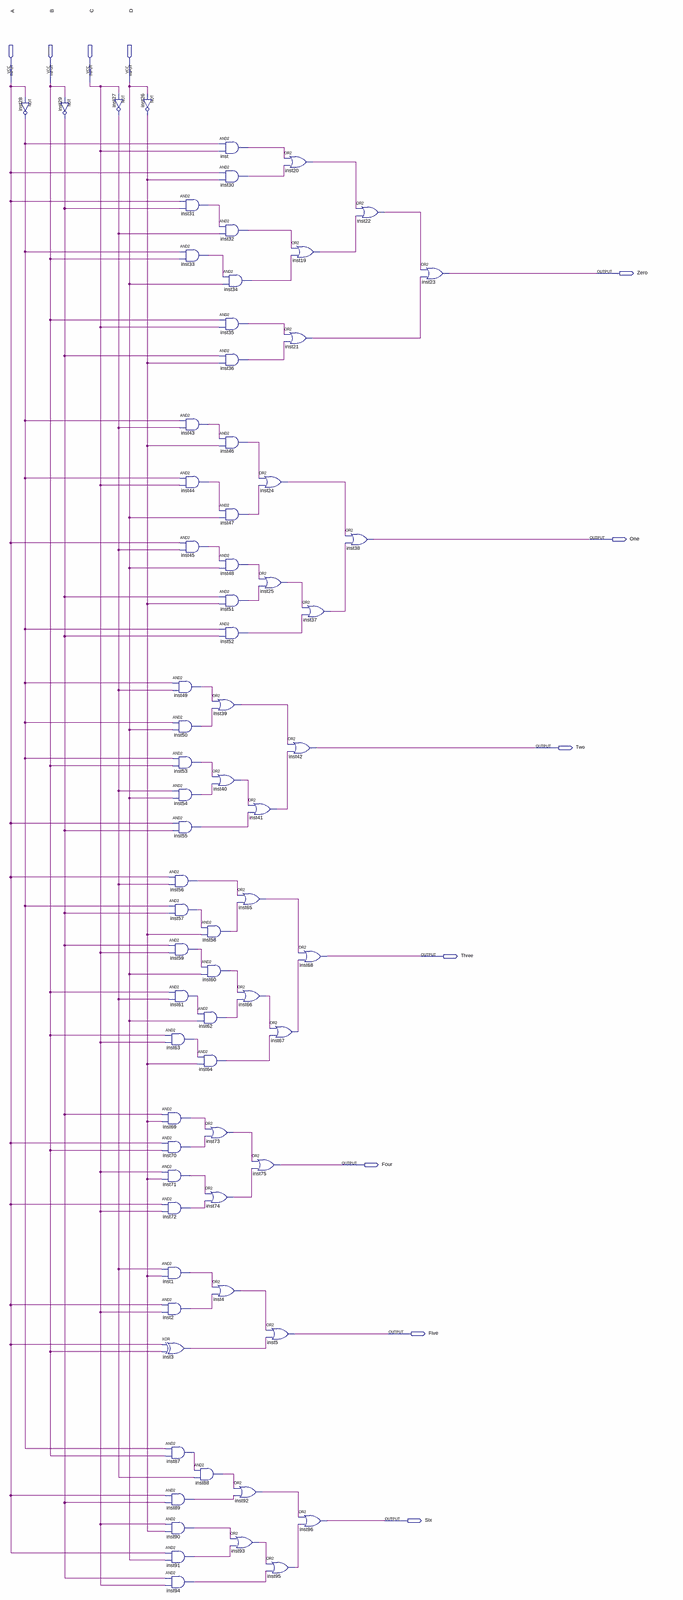
[diagram p0: schematic sheet, whole]
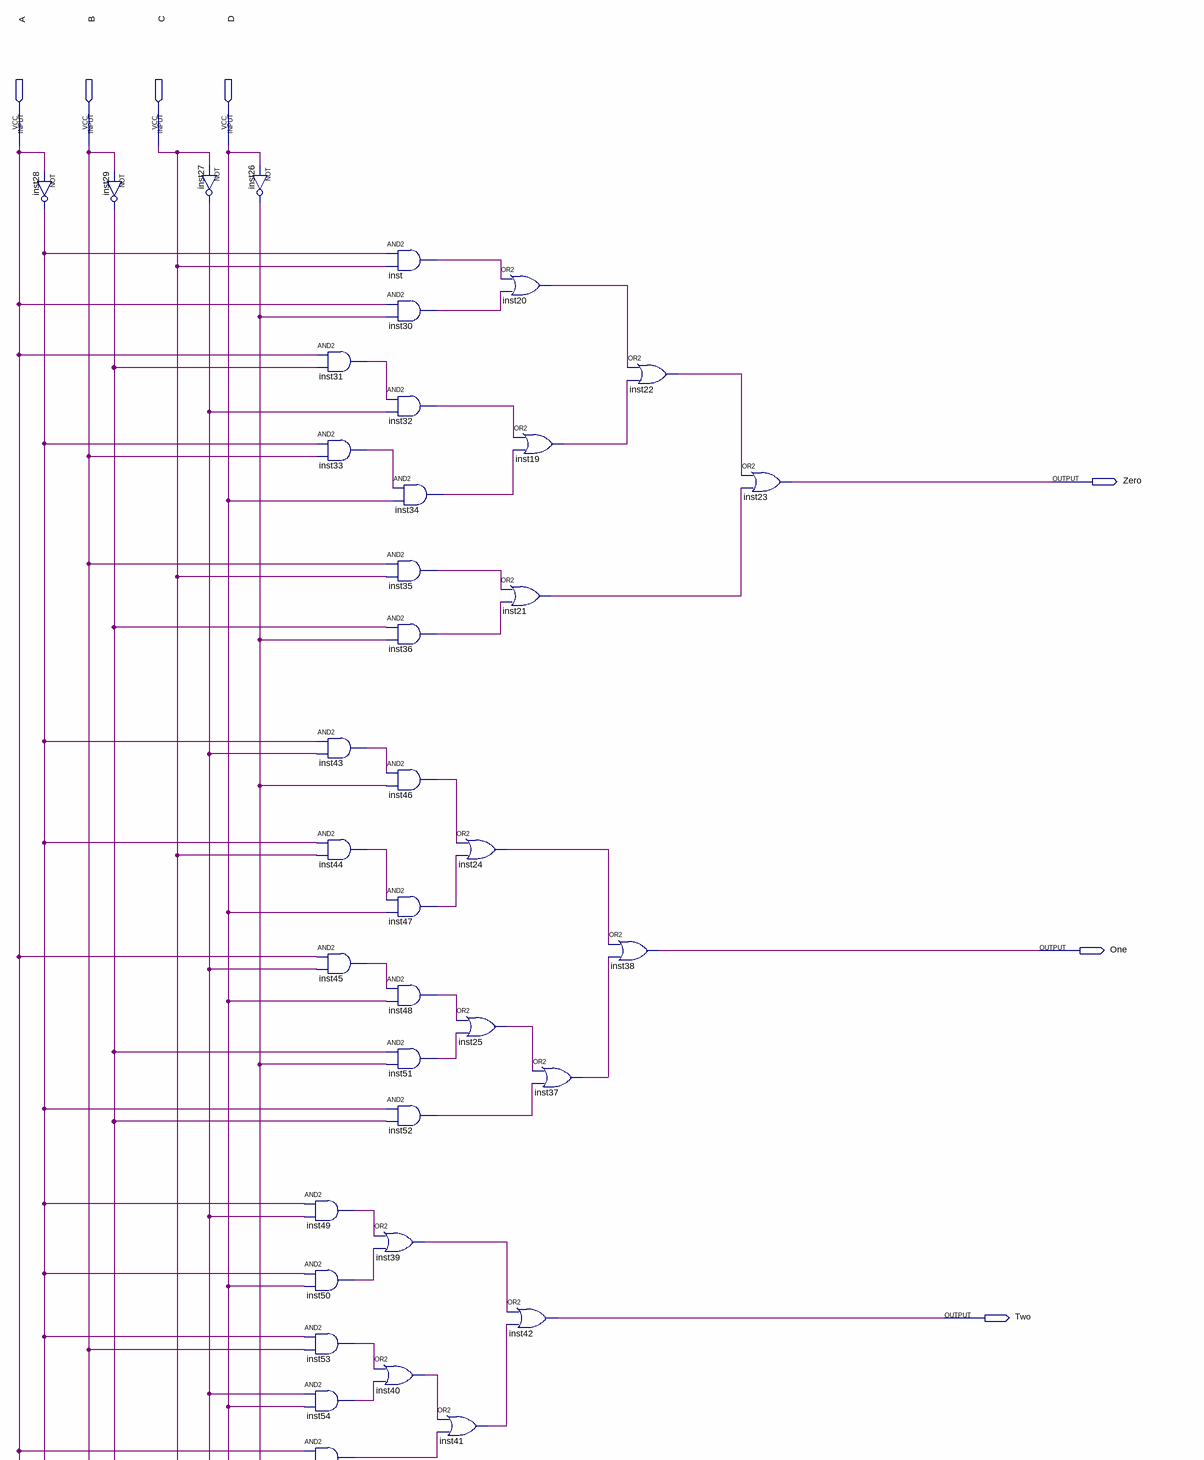
[diagram p1: schematic sheet, upper part]
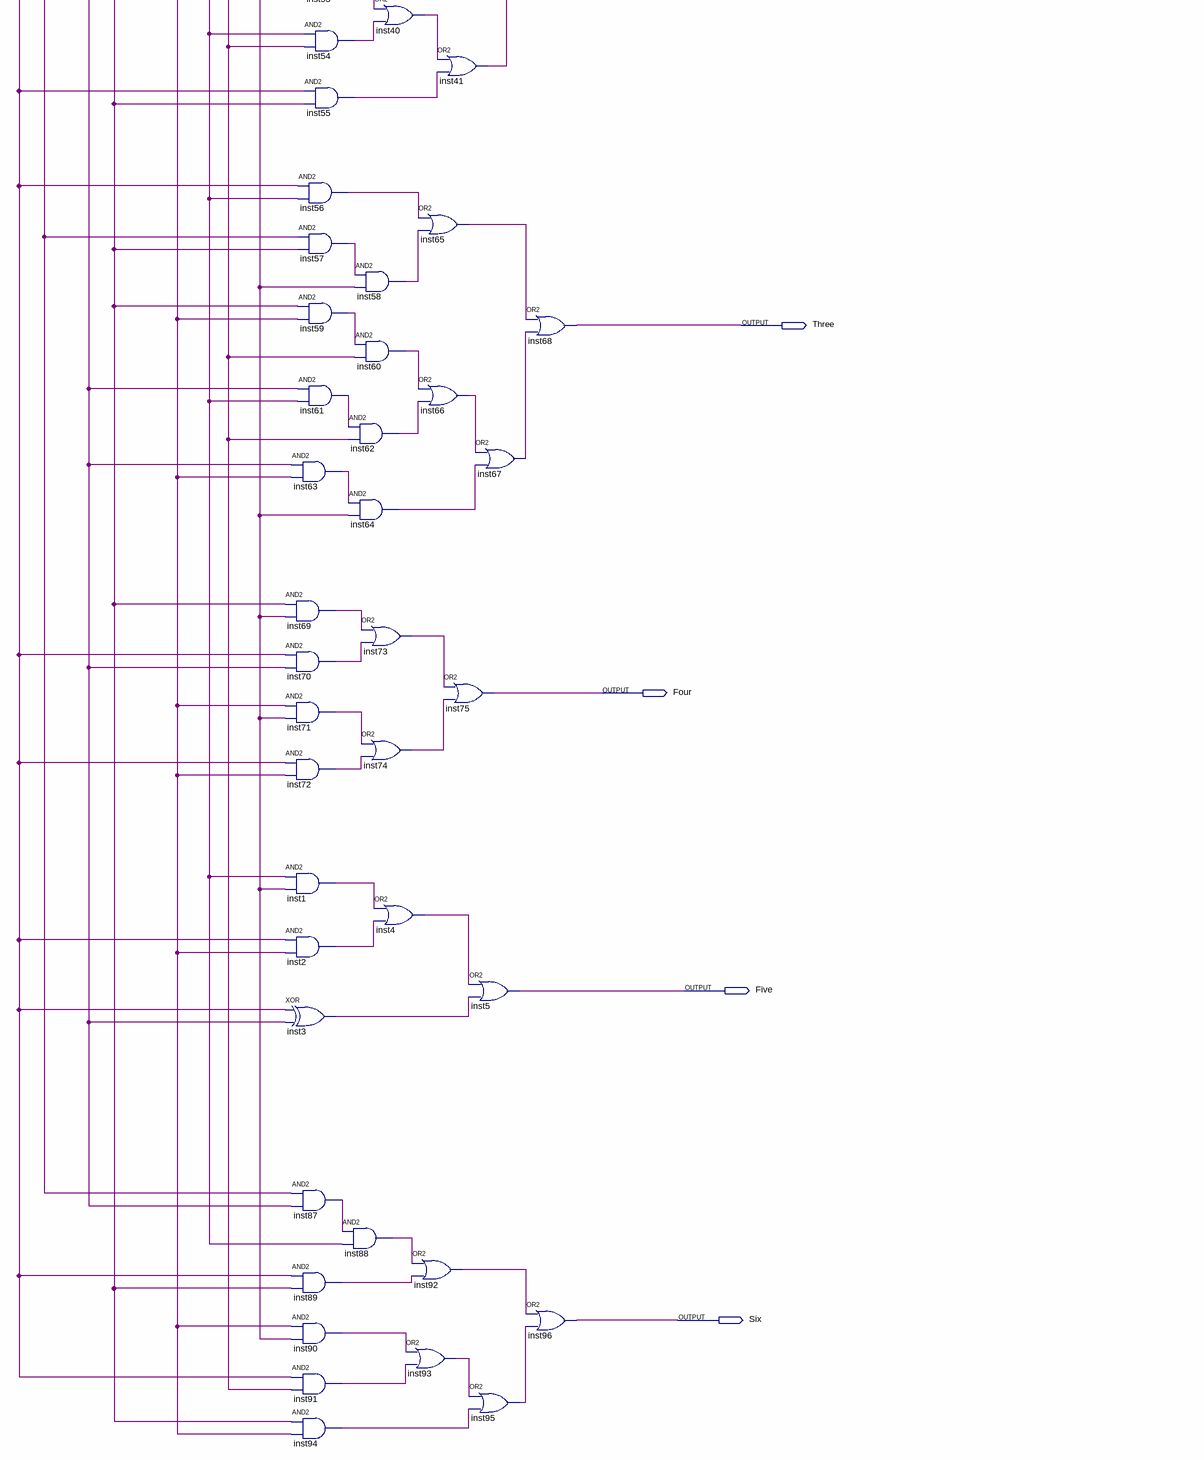
[diagram p2: schematic sheet, lower part]
// Quartus schematic ex1_1.bdf as structural Verilog: 73 symbols, 11 pins
module ex1_1 (
  input  A,
  input  B,
  input  C,
  input  D,
  output Zero,
  output One,
  output Two,
  output Three,
  output Four,
  output Five,
  output Six
);

  wire inst1_out, inst2_out, inst3_out, inst4_out, inst19_out, inst20_out, inst21_out, inst22_out,
       inst24_out, inst25_out, inst26_out, inst27_out, inst28_out, inst29_out, inst30_out, inst31_out,
       inst32_out, inst33_out, inst34_out, inst35_out, inst36_out, inst37_out, inst39_out, inst40_out,
       inst41_out, inst43_out, inst44_out, inst45_out, inst46_out, inst47_out, inst48_out, inst49_out,
       inst50_out, inst51_out, inst52_out, inst53_out, inst54_out, inst55_out, inst56_out, inst57_out,
       inst58_out, inst59_out, inst60_out, inst61_out, inst62_out, inst63_out, inst64_out, inst65_out,
       inst66_out, inst67_out, inst69_out, inst70_out, inst71_out, inst72_out, inst73_out, inst74_out,
       inst87_out, inst88_out, inst89_out, inst90_out, inst91_out, inst92_out, inst93_out, inst94_out,
       inst95_out, inst_out;

  not inst28 (inst28_out, A);
  not inst29 (inst29_out, B);
  not inst27 (inst27_out, C);
  not inst26 (inst26_out, D);
  and inst69 (inst69_out, inst29_out, inst26_out);
  and inst70 (inst70_out, A, B);
  and inst71 (inst71_out, C, inst26_out);
  and inst72 (inst72_out, A, C);
  and inst1 (inst1_out, inst27_out, inst26_out);
  and inst2 (inst2_out, A, C);
  xor inst3 (inst3_out, A, B);
  and inst31 (inst31_out, A, inst29_out);
  and inst33 (inst33_out, inst28_out, B);
  and inst43 (inst43_out, inst28_out, inst27_out);
  and inst44 (inst44_out, inst28_out, C);
  and inst45 (inst45_out, A, inst27_out);
  and inst49 (inst49_out, inst28_out, inst27_out);
  and inst50 (inst50_out, inst28_out, D);
  and inst53 (inst53_out, inst28_out, B);
  and inst54 (inst54_out, inst27_out, D);
  and inst55 (inst55_out, A, inst29_out);
  and inst56 (inst56_out, A, inst27_out);
  and inst57 (inst57_out, inst28_out, inst29_out);
  and inst59 (inst59_out, inst29_out, C);
  and inst61 (inst61_out, B, inst27_out);
  and inst63 (inst63_out, B, C);
  and inst87 (inst87_out, inst28_out, B);
  and inst89 (inst89_out, A, inst29_out);
  and inst90 (inst90_out, C, inst26_out);
  and inst91 (inst91_out, A, D);
  and inst94 (inst94_out, inst29_out, C);
  and inst (inst_out, inst28_out, C);
  and inst30 (inst30_out, A, inst26_out);
  and inst32 (inst32_out, inst31_out, inst27_out);
  and inst35 (inst35_out, B, C);
  and inst36 (inst36_out, inst29_out, inst26_out);
  and inst46 (inst46_out, inst43_out, inst26_out);
  and inst47 (inst47_out, inst44_out, D);
  and inst48 (inst48_out, inst45_out, D);
  and inst51 (inst51_out, inst29_out, inst26_out);
  and inst52 (inst52_out, inst28_out, inst29_out);
  or inst39 (inst39_out, inst49_out, inst50_out);
  or inst40 (inst40_out, inst53_out, inst54_out);
  and inst58 (inst58_out, inst57_out, inst26_out);
  and inst60 (inst60_out, inst59_out, D);
  and inst62 (inst62_out, inst61_out, D);
  and inst64 (inst64_out, inst63_out, inst26_out);
  or inst73 (inst73_out, inst69_out, inst70_out);
  or inst74 (inst74_out, inst71_out, inst72_out);
  or inst4 (inst4_out, inst1_out, inst2_out);
  and inst88 (inst88_out, inst87_out, inst27_out);
  and inst34 (inst34_out, inst33_out, D);
  or inst41 (inst41_out, inst40_out, inst55_out);
  or inst65 (inst65_out, inst56_out, inst58_out);
  or inst66 (inst66_out, inst60_out, inst62_out);
  or inst92 (inst92_out, inst88_out, inst89_out);
  or inst93 (inst93_out, inst90_out, inst91_out);
  or inst24 (inst24_out, inst46_out, inst47_out);
  or inst25 (inst25_out, inst48_out, inst51_out);
  or inst67 (inst67_out, inst66_out, inst64_out);
  or inst75 (Four, inst73_out, inst74_out);
  or inst5 (Five, inst4_out, inst3_out);
  or inst95 (inst95_out, inst93_out, inst94_out);
  or inst20 (inst20_out, inst_out, inst30_out);
  or inst19 (inst19_out, inst32_out, inst34_out);
  or inst21 (inst21_out, inst35_out, inst36_out);
  or inst37 (inst37_out, inst25_out, inst52_out);
  or inst42 (Two, inst39_out, inst41_out);
  or inst68 (Three, inst65_out, inst67_out);
  or inst96 (Six, inst92_out, inst95_out);
  or inst22 (inst22_out, inst20_out, inst19_out);
  or inst38 (One, inst24_out, inst37_out);
  or inst23 (Zero, inst22_out, inst21_out);
endmodule
